# Altium project PowerUnit.PrjPCB
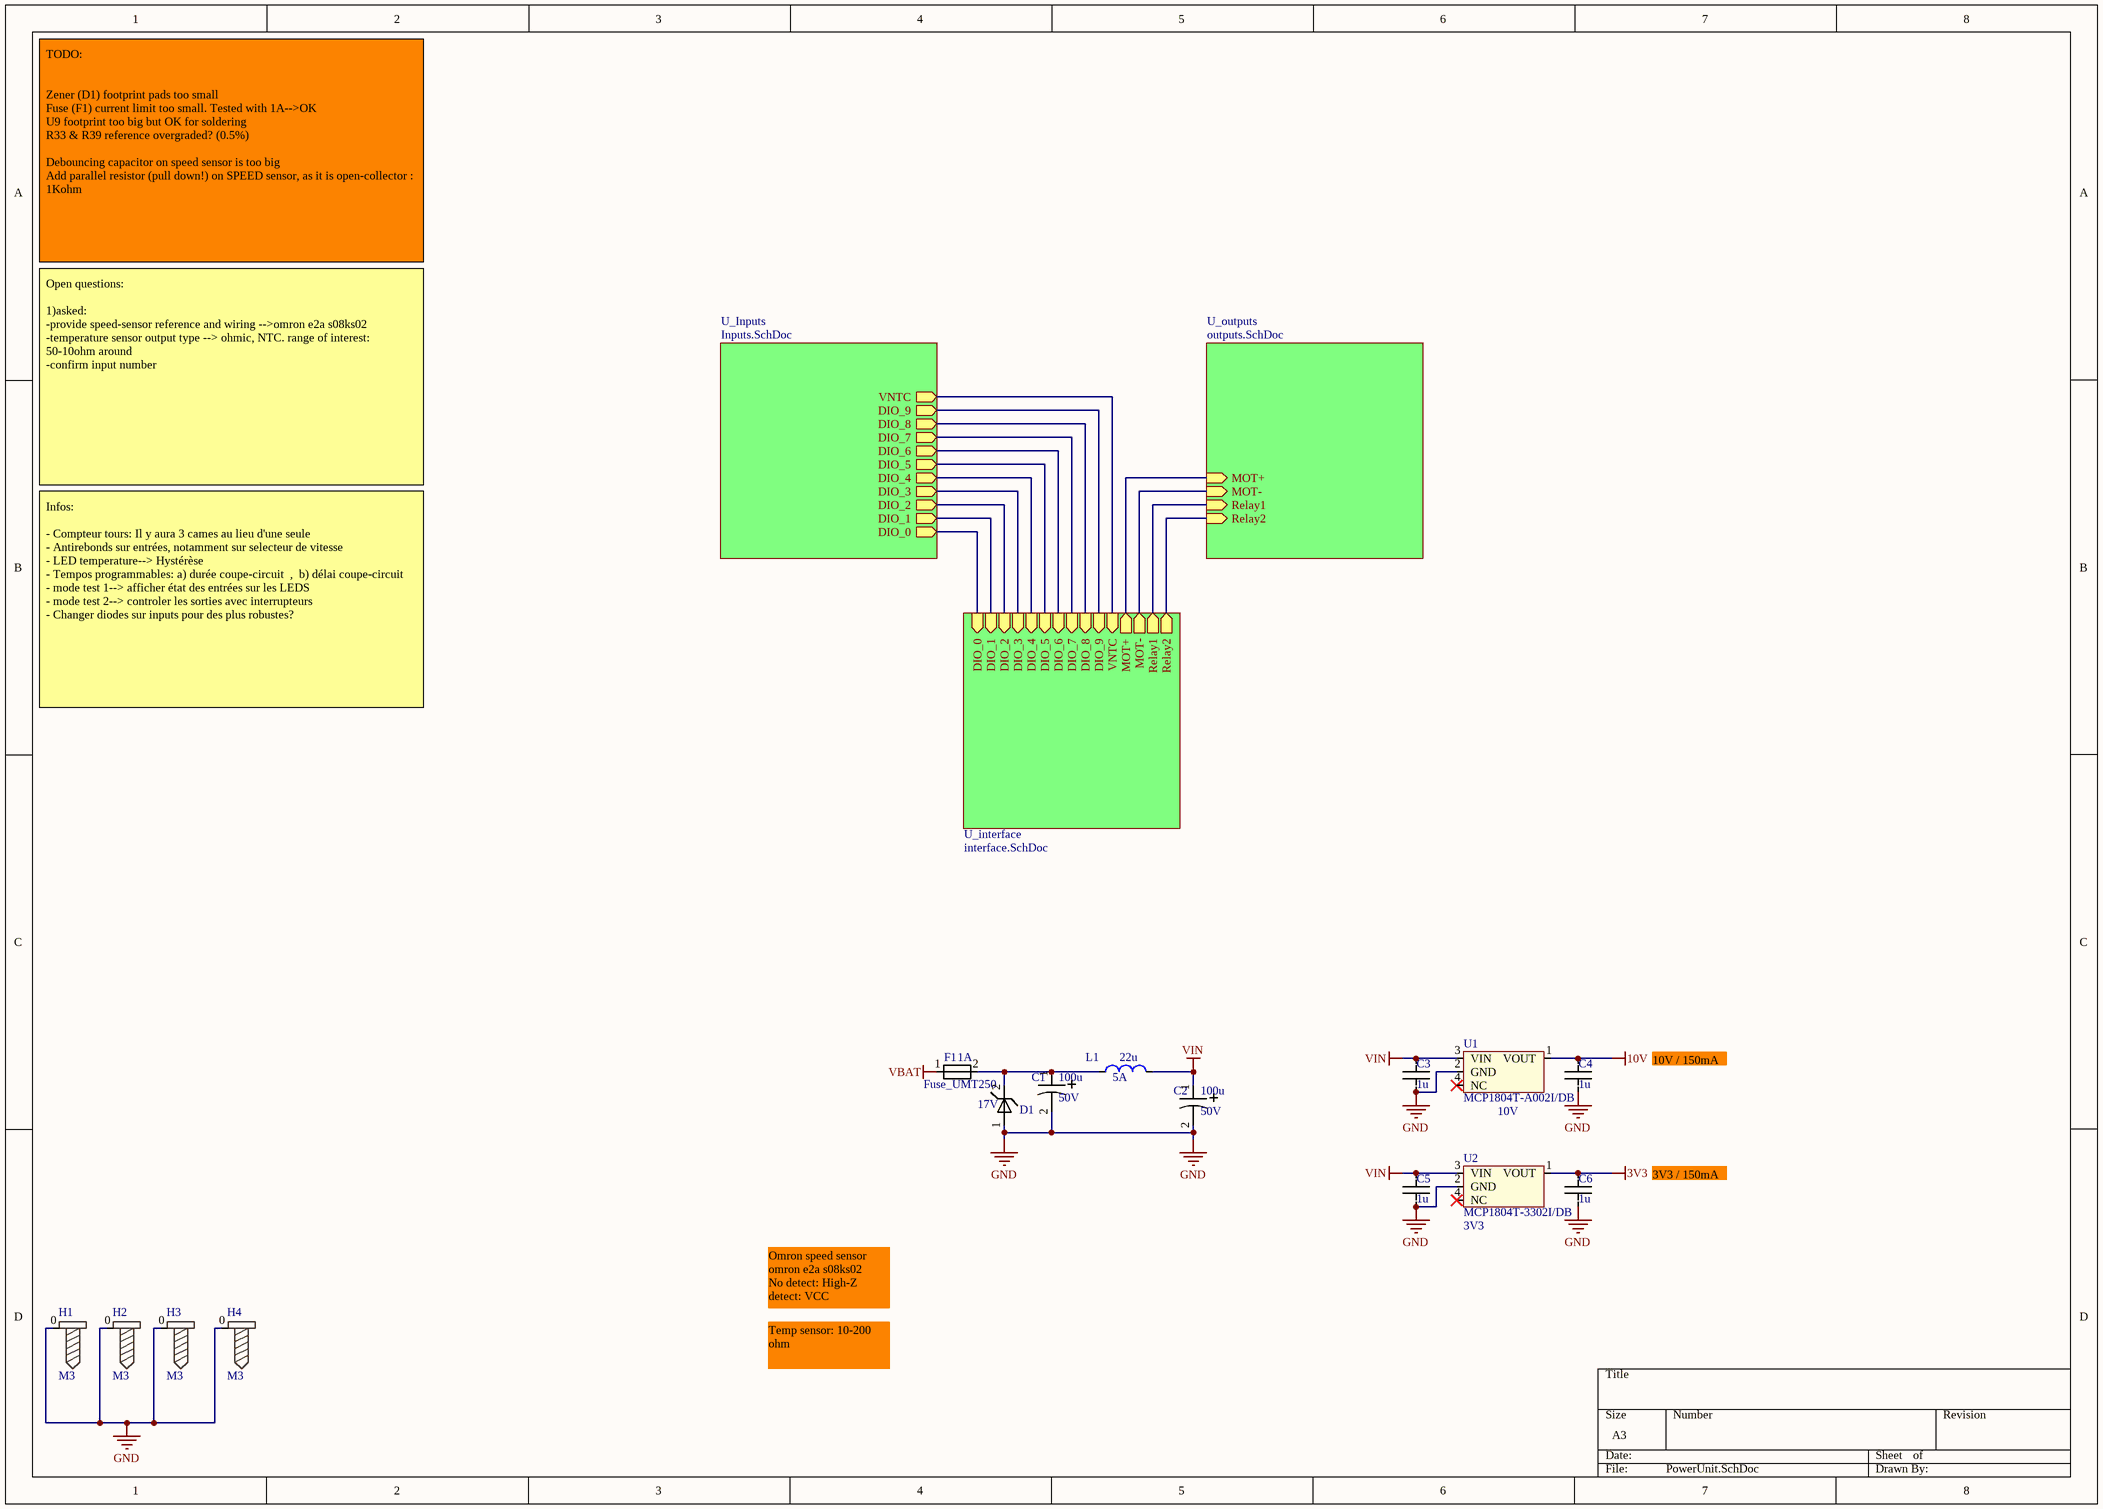
[diagram p0: PowerUnit.SchDoc]
4 sheets, 134 parts. Net scope: hierarchical (ports join the sheet entries above them; power ports are global).
Board file: PowerUnit.PcbDoc
Sheets:
  PowerUnit.SchDoc
    U_Inputs = Inputs.SchDoc
    U_outputs = outputs.SchDoc
    U_interface = interface.SchDoc

## Sheet PowerUnit.SchDoc
size A3

### Parts
C1  value 100u  Rated voltage: 50V  [C_pol8x12mm]  (hidden comment: C_pol)
C2  value 100u  Rated voltage: 50V  [C_pol8x12mm]  (hidden comment: C_pol)
C3  1u  [0402_]
C4  1u  [0402_]
C5  1u  [0402_]
C6  1u  [0402_]
D1  Vz: 17V  [R_DIL_vertical_holes1_2mm]  (hidden comment: Zener)
F1  Fuse_UMT250  Calibre: 1A  [FUSE_UMT250]
H1  M3  [Mechanical_hole]  (no BOM)
H2  M3  [Mechanical_hole]  (no BOM)
H3  M3  [Mechanical_hole]  (no BOM)
H4  M3  [Mechanical_hole]  (no BOM)
L1  value 22u  current: 5A  [WURTH_7447709220]  (hidden comment: Inductor)
U1  MCP1804T-A002I/DB  Output voltage: 10V  [SOT223-4M]
U2  MCP1804T-3302I/DB  Output voltage: 3V3  [SOT223-4M]

### Sub-sheets
U_Inputs = Inputs.SchDoc: DIO_0 (out), DIO_1 (out), DIO_2 (out), DIO_3 (out), DIO_4 (out), DIO_5 (out), DIO_6 (out), DIO_7 (out), VNTC (out), DIO_8 (out), DIO_9 (out)
U_interface = interface.SchDoc: DIO_0 (in), DIO_1 (in), DIO_2 (in), DIO_3 (in), DIO_4 (in), DIO_5 (in), DIO_6 (in), DIO_7 (in), VNTC (in), MOT+ (out), MOT- (out), DIO_8 (in), DIO_9 (in), Relay2 (out), Relay1 (out)
U_outputs = outputs.SchDoc: MOT+ (in), MOT- (in), Relay2 (in), Relay1 (in)

### Nets
3V3: C6.1 U2.1(VOUT)
10V: C4.1 U1.1(VOUT)
GND: C1.2 C2.2 C3.2 C4.2 C5.2 C6.2 D1.1 H1.0 H2.0 H3.0 H4.0 U1.2(GND) U2.2(GND)
VBAT: F1.1
VIN: C2.1 C3.1 C5.1 L1.2 U1.3(VIN) U2.3(VIN)
Embray_OUT: sheet U_Inputs/DIO_4, sheet U_interface/DIO_4
Gas_OUT: sheet U_Inputs/DIO_5, sheet U_interface/DIO_5
Huile_OUT: sheet U_Inputs/DIO_9, sheet U_interface/DIO_9
MOT+_IN: sheet U_outputs/MOT+, sheet U_interface/MOT+
MOT-_IN: sheet U_outputs/MOT-, sheet U_interface/MOT-
Neutre_OUT: sheet U_Inputs/DIO_6, sheet U_interface/DIO_6
P1_OUT: sheet U_Inputs/DIO_2, sheet U_interface/DIO_2
P2_OUT: sheet U_Inputs/DIO_1, sheet U_interface/DIO_1
Rapport+_OUT: sheet U_Inputs/DIO_0, sheet U_interface/DIO_0
Rapport-_OUT: sheet U_Inputs/DIO_3, sheet U_interface/DIO_3
Regime_OUT: sheet U_Inputs/DIO_8, sheet U_interface/DIO_8
RELAY1_IN: sheet U_outputs/Relay1, sheet U_interface/Relay1
RELAY2_IN: sheet U_outputs/Relay2, sheet U_interface/Relay2
Res_OUT: sheet U_Inputs/DIO_7, sheet U_interface/DIO_7
VNTC: sheet U_Inputs/VNTC, sheet U_interface/VNTC
NetC1_1: C1.1 D1.2 F1.2 L1.1

Not connected (* = marked no-connect by the designer): U1 4(NC)*; U2 4(NC)*

### Notes on the sheet
- TODO:
  Zener (D1) footprint pads too small
  Fuse (F1) current limit too small. Tested with 1A-->OK
  U9 footprint too big but OK for soldering
  R33 & R39 reference overgraded? (0.5%)
  Debouncing capacitor on speed sensor is too big
  Add parallel resistor (pull down!) on SPEED sensor, as it is open-collector : 1Kohm
- Open questions:
  1)asked:
  -provide speed-sensor reference and wiring -->omron e2a s08ks02
  -temperature sensor output type --> ohmic, NTC. range of interest: 50-10ohm around
  -confirm input number
- Infos:
  - Compteur tours: Il y aura 3 cames au lieu d'une seule
  - Antirebonds sur entrées, notamment sur selecteur de vitesse
  - LED temperature--> Hystérèse
  - Tempos programmables: a) durée coupe-circuit  ,  b) délai coupe-circuit
  - mode test 1--> afficher état des entrées sur les LEDS
  - mode test 2--> controler les sorties avec interrupteurs
  - Changer diodes sur inputs pour des plus robustes?
- 10V / 150mA
- 3V3 / 150mA
- Omron speed sensor
  omron e2a s08ks02
  No detect: High-Z
  detect: VCC
- Temp sensor: 10-200 ohm

### Library data of the parts
C1 C2 = C_pol: Manufacturer: Nichicon; Manufacturer PartNum: UVR1H101MPD1TD; Digikey ref: 493-5916-1-ND
C3-C6 = C: Manufacturer PartNum: GRM155R61E105MA12D; Manufacturer: Murata; Nominal voltage: 25V; value: 1u; Digikey ref: 490-10018-1-ND
D1 = Zener: Manufacturer: ON Semi; Manufacturer PartNum: 1N5354BG; Digikey ref: 1N5354BGOS-ND
F1 = Fuse_UMT250: Manufacturer PartNum: 3403.0166.11; Manufacturer: Schurter Inc; Unominal: 250V; Type: Temporisé; Digikey ref: 486-1247-ND; Farnell ref: 1221090; Mouser ref: 693-3403.0166.11
H1-H4 = trous_de_fixation: value: M3
L1 = Inductor: Manufacturer PartNum: 7447709220; Manufacturer: Wurth Electronics Inc; Digikey ref: 732-1243-1-ND; Digikey ref 2 (was unavailable): SRP1038A-220MCT-ND
U1 = MCP1804T-A002I/DB: IC REG LDO 10V 0.15A SOT223-3; Manufacturer: Microchip; Digikey ref: MCP1804T-A002I/DBCT-ND; Manufacturer PartNum: MCP1804T-A002I/DB
U2 = MCP1804T-3302I/DB: IC REG LDO 3.3V 0.15A SOT223-3; Manufacturer: Microchip; Digikey ref: MCP1804T-3302I/DBCT-ND; Manufacturer PartNum: MCP1804T-3302I/DB

## Sheet Inputs.SchDoc
size A3
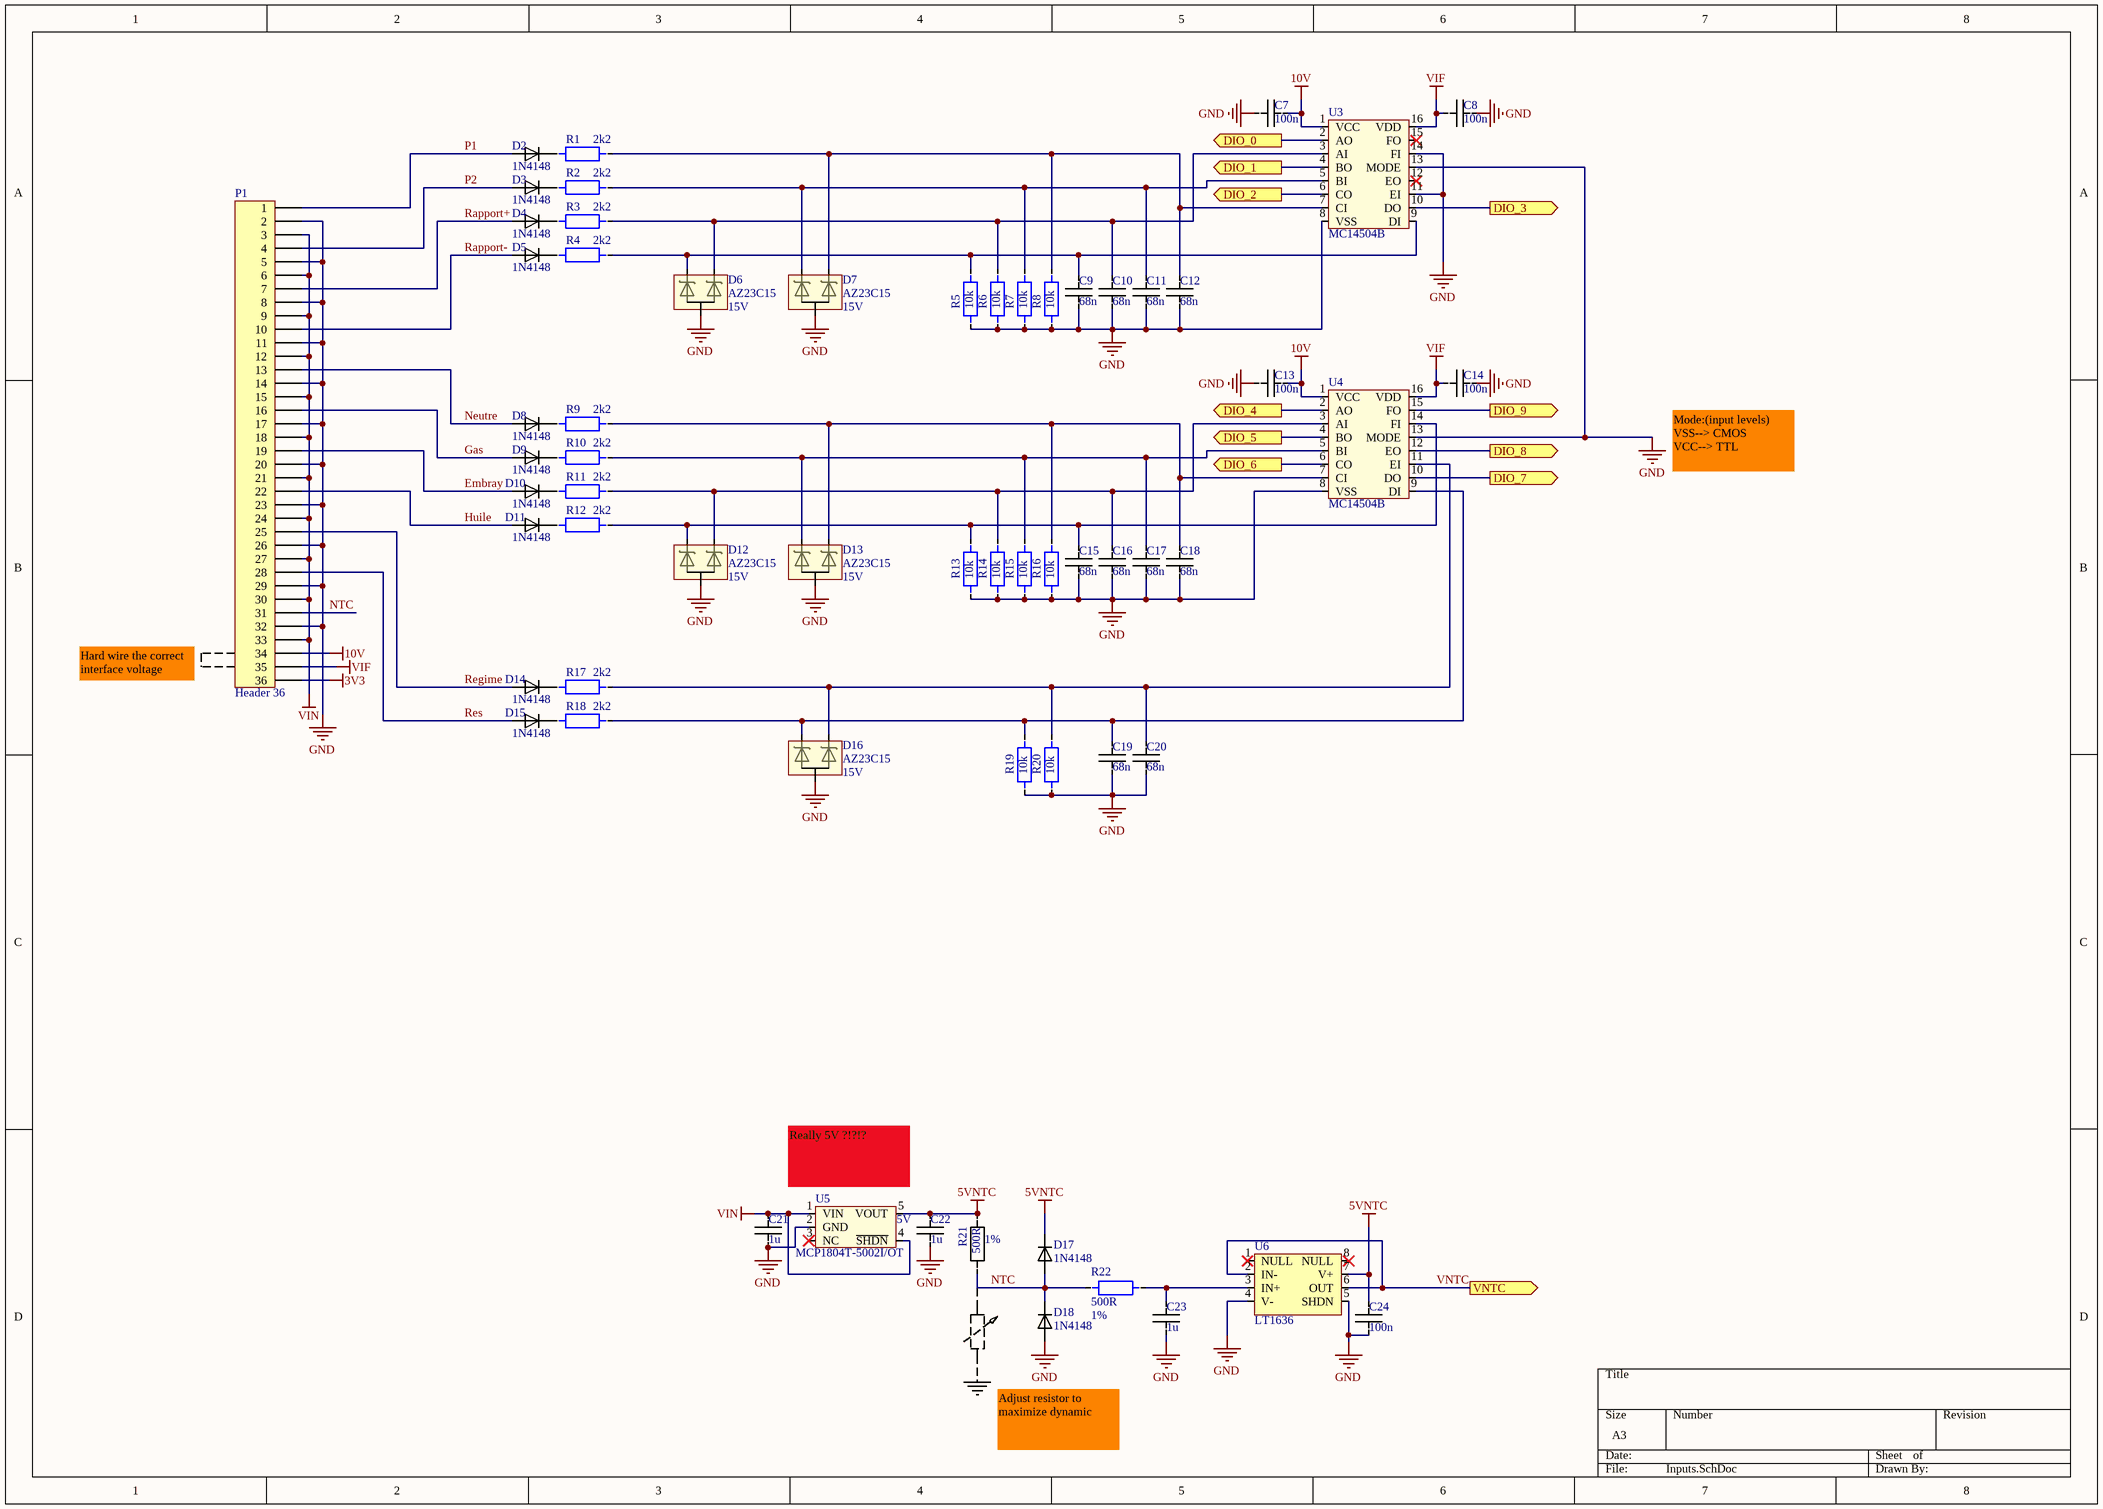
[diagram p1: Inputs.SchDoc]

### Parts
C7  100n  [0402_]
C8  100n  [0402_]
C9  68n  [0603_]
C10  68n  [0603_]
C11  68n  [0603_]
C12  68n  [0603_]
C13  100n  [0402_]
C14  100n  [0402_]
C15  68n  [0603_]
C16  68n  [0603_]
C17  68n  [0603_]
C18  68n  [0603_]
C19  68n  [0603_]
C20  68n  [0603_]
C21  1u  [0402_]
C22  1u  [0402_]
C23  1u  [0402_]
C24  100n  [0402_]
D2  1N4148  [SOD323]
D3  1N4148  [SOD323]
D4  1N4148  [SOD323]
D5  1N4148  [SOD323]
D6  AZ23C15  Vz: 15V  [SOT23]
D7  AZ23C15  Vz: 15V  [SOT23]
D8  1N4148  [SOD323]
D9  1N4148  [SOD323]
D10  1N4148  [SOD323]
D11  1N4148  [SOD323]
D12  AZ23C15  Vz: 15V  [SOT23]
D13  AZ23C15  Vz: 15V  [SOT23]
D14  1N4148  [SOD323]
D15  1N4148  [SOD323]
D16  AZ23C15  Vz: 15V  [SOT23]
D17  1N4148  [SOD323]
D18  1N4148  [SOD323]
P1  Header 36  [PHOENIX_PTSA05_36]
R1  2k2  [0805_]
R2  2k2  [0805_]
R3  2k2  [0805_]
R4  2k2  [0805_]
R5  10k  [0402_]
R6  10k  [0402_]
R7  10k  [0402_]
R8  10k  [0402_]
R9  2k2  [0805_]
R10  2k2  [0805_]
R11  2k2  [0805_]
R12  2k2  [0805_]
R13  10k  [0402_]
R14  10k  [0402_]
R15  10k  [0402_]
R16  10k  [0402_]
R17  2k2  [0805_]
R18  2k2  [0805_]
R19  10k  [0402_]
R20  10k  [0402_]
R21  precision: 1%  [0805_]  (hidden comment: 500R)
R22  precision: 1%  [0805_]  (hidden comment: 500R)
U3  MC14504B  [SOIC16]
U4  MC14504B  [SOIC16]
U5  MCP1804T-5002I/OT  Rated volatage: 5V  [sot23-5]
U6  LT1636  [soic8]

### Ports
DIO_0 (out), DIO_1 (out), DIO_2 (out), DIO_3 (out), DIO_4 (out), DIO_5 (out), DIO_6 (out), DIO_7 (out), DIO_8 (out), DIO_9 (out), VNTC (out)

### Nets
3V3: P1.36
5VNTC: C22.1 C24.1 D17.2 R21.2 U5.5(VOUT) U6.7(V+)
10V: C7.1 C13.1 P1.34 U3.1(VCC) U4.1(VCC)
GND: C7.2 C8.1 C9.1 C10.1 C11.1 C12.1 C13.2 C14.1 C15.1 C16.1 C17.1 C18.1 C19.1 C20.1 C21.2 C22.2 C23.2 C24.2 D6.3 D7.3 D12.3 D13.3 D16.3 D18.1 P1.2 P1.5 P1.8 P1.11 P1.14 P1.17 P1.20 P1.23 P1.26 P1.29 P1.32 R5.1 R6.1 R7.1 R8.1 R13.1 R14.1 R15.1 R16.1 R19.1 R20.1 U3.8(VSS) U3.11(EI) U3.13(MODE) U3.14(FI) U4.8(VSS) U4.13(MODE) U5.2(GND) U6.4(V-) U6.5(SHDN)
VIF: C8.2 C14.2 P1.35 U3.16(VDD) U4.16(VDD)
VIN: C21.1 P1.3 P1.6 P1.9 P1.12 P1.15 P1.18 P1.21 P1.24 P1.27 P1.30 P1.33 U5.1(VIN) U5.4(~{SHDN})
Embray: D10.1 P1.19
Embray_OUT: U4.2(AO) ; port DIO_4
Gas: D9.1 P1.16
Gas_OUT: U4.4(BO) ; port DIO_5
Huile: D11.1 P1.22
Huile_OUT: U4.15(FO) ; port DIO_9
Neutre: D8.1 P1.13
Neutre_OUT: U4.6(CO) ; port DIO_6
NTC: D17.1 D18.2 P1.31 R21.1 R22.2
P1: D2.1 P1.1
P1_OUT: U3.6(CO) ; port DIO_2
P2: D3.1 P1.4
P2_OUT: U3.4(BO) ; port DIO_1
Rapport+: D4.1 P1.7
Rapport+_OUT: U3.2(AO) ; port DIO_0
Rapport-: D5.1 P1.10
Rapport-_OUT: U3.10(DO) ; port DIO_3
Regime: D14.1 P1.25
Regime_OUT: U4.12(EO) ; port DIO_8
Res: D15.1 P1.28
Res_OUT: U4.10(DO) ; port DIO_7
VNTC: U6.2(IN-) U6.6(OUT) ; port VNTC
NetC9_2: C9.2 D6.2 R4.1 R5.2 U3.9(DI)
NetC10_2: C10.2 D6.1 R3.1 R6.2 U3.3(AI)
NetC11_2: C11.2 D7.2 R2.1 R7.2 U3.5(BI)
NetC12_2: C12.2 D7.1 R1.1 R8.2 U3.7(CI)
NetC15_2: C15.2 D12.2 R12.1 R13.2 U4.14(FI)
NetC16_2: C16.2 D12.1 R11.1 R14.2 U4.3(AI)
NetC17_2: C17.2 D13.2 R10.1 R15.2 U4.5(BI)
NetC18_2: C18.2 D13.1 R9.1 R16.2 U4.7(CI)
NetC19_2: C19.2 D16.2 R18.1 R19.2 U4.9(DI)
NetC20_2: C20.2 D16.1 R17.1 R20.2 U4.11(EI)
NetC23_1: C23.1 R22.1 U6.3(IN+)
NetD2_2: D2.2 R1.2
NetD3_2: D3.2 R2.2
NetD4_2: D4.2 R3.2
NetD5_2: D5.2 R4.2
NetD8_2: D8.2 R9.2
NetD9_2: D9.2 R10.2
NetD10_2: D10.2 R11.2
NetD11_2: D11.2 R12.2
NetD14_2: D14.2 R17.2
NetD15_2: D15.2 R18.2

Not connected (* = marked no-connect by the designer): U3 12(EO)* 15(FO)*; U5 3(NC)*; U6 1(NULL)* 8(NULL)*

### Notes on the sheet
- Mode:(input levels)
  VSS--> CMOS
  VCC--> TTL
- Hard wire the correct interface voltage
- Really 5V ?!?!?
- Adjust resistor to maximize dynamic

### Library data of the parts
C7 C8 C13 C14 = C: Manufacturer: TDK Corp.; Manufacturer PartNum: C1005X5R1E104K050BC; value: 100n; Digikey ref: 445-4964-1-ND
C9-C12 C15-C20 = C: Manufacturer: Samsung; Manufacturer PartNum: CL10B683KB8NNNC; Nominal voltage: 50V; Digikey ref: 1276-1814-1-ND; Value: 68n
C21-C23 = C: as C3 on sheet PowerUnit; value: 1u; Digikey ref: 490-10018-1-ND
C24 = C: Manufacturer: TDK Corp.; Manufacturer PartNum: C1005X5R1E104K050BC; Voltage: 25V; value: 100n; Digikey ref: 445-4964-1-ND
D2-D5 D8-D11 D14 D15 D17 D18 = 1N4148: Manufacturer: Micro Commercial Co; Manufacturer PartNum: 1N4148WX-TP; Digikey ref: 1N4148WXTPMSCT-ND
D6 D7 D12 D13 D16 = AZ23C15: DIODE ZENER ARRAY 15V SOT23-3; Manufacturer PartNum: AZ23C15-7-F; Manufacturer: Diodes Inc.; Digikey ref: AZ23C15-FDICT-ND
P1 = Header 36: Header, 36-Pin; Manufacturer PartNum: 1990164; Manufacturer: Phoenix Contact; LatestRevisionDate: 17-Jul-2002; LatestRevisionNote: Re-released for DXP Platform.; Publisher: Altium Limited; Digikey ref: 277-1810-ND
R1-R4 R9-R12 R17 R18 = R: Manufacturer: Yageo; Manufacturer PartNum: RC0805JR-072K2L; value: 2k2; Digikey ref: 311-2.2KARCT-ND
R5-R8 R13-R16 R19 R20 = R: Manufacturer PartNum: ERJ-2RKF1002X; Manufacturer: Panasonic; value: 10k; Digikey ref: P10.0KLCT-ND
R21 R22 = R: Manufacturer PartNum: RC0805FR-07510RL; Manufacturer: Yageo; value: 500R; Digikey ref: 311-510CRCT-ND
U3 U4 = MC14504B: IC LEVEL SHIFTER HEX 16-SOIC; Manufacturer: On Semi; Manufacturer PartNum: MC14504BDG; Digikey ref: MC14504BDGOS-ND
U5 = MCP1804T-5002I/OT: IC REG LDO 5V 0.15A SOT23-5; Manufacturer: Microchip; Digikey ref: MCP1804T-5002I/OTCT-ND; Manufacturer PartNum: MCP1804T-5002I/OT
U6 = LT1636: IC OPAMP GP 220KHZ RRO 8SO SHTDN; Manufacturer PartNum: LT1636CS8#PBF; Manufacturer: Linear Technology; Digikey ref: LT1636CS8#PBF-ND

## Sheet outputs.SchDoc
size A3
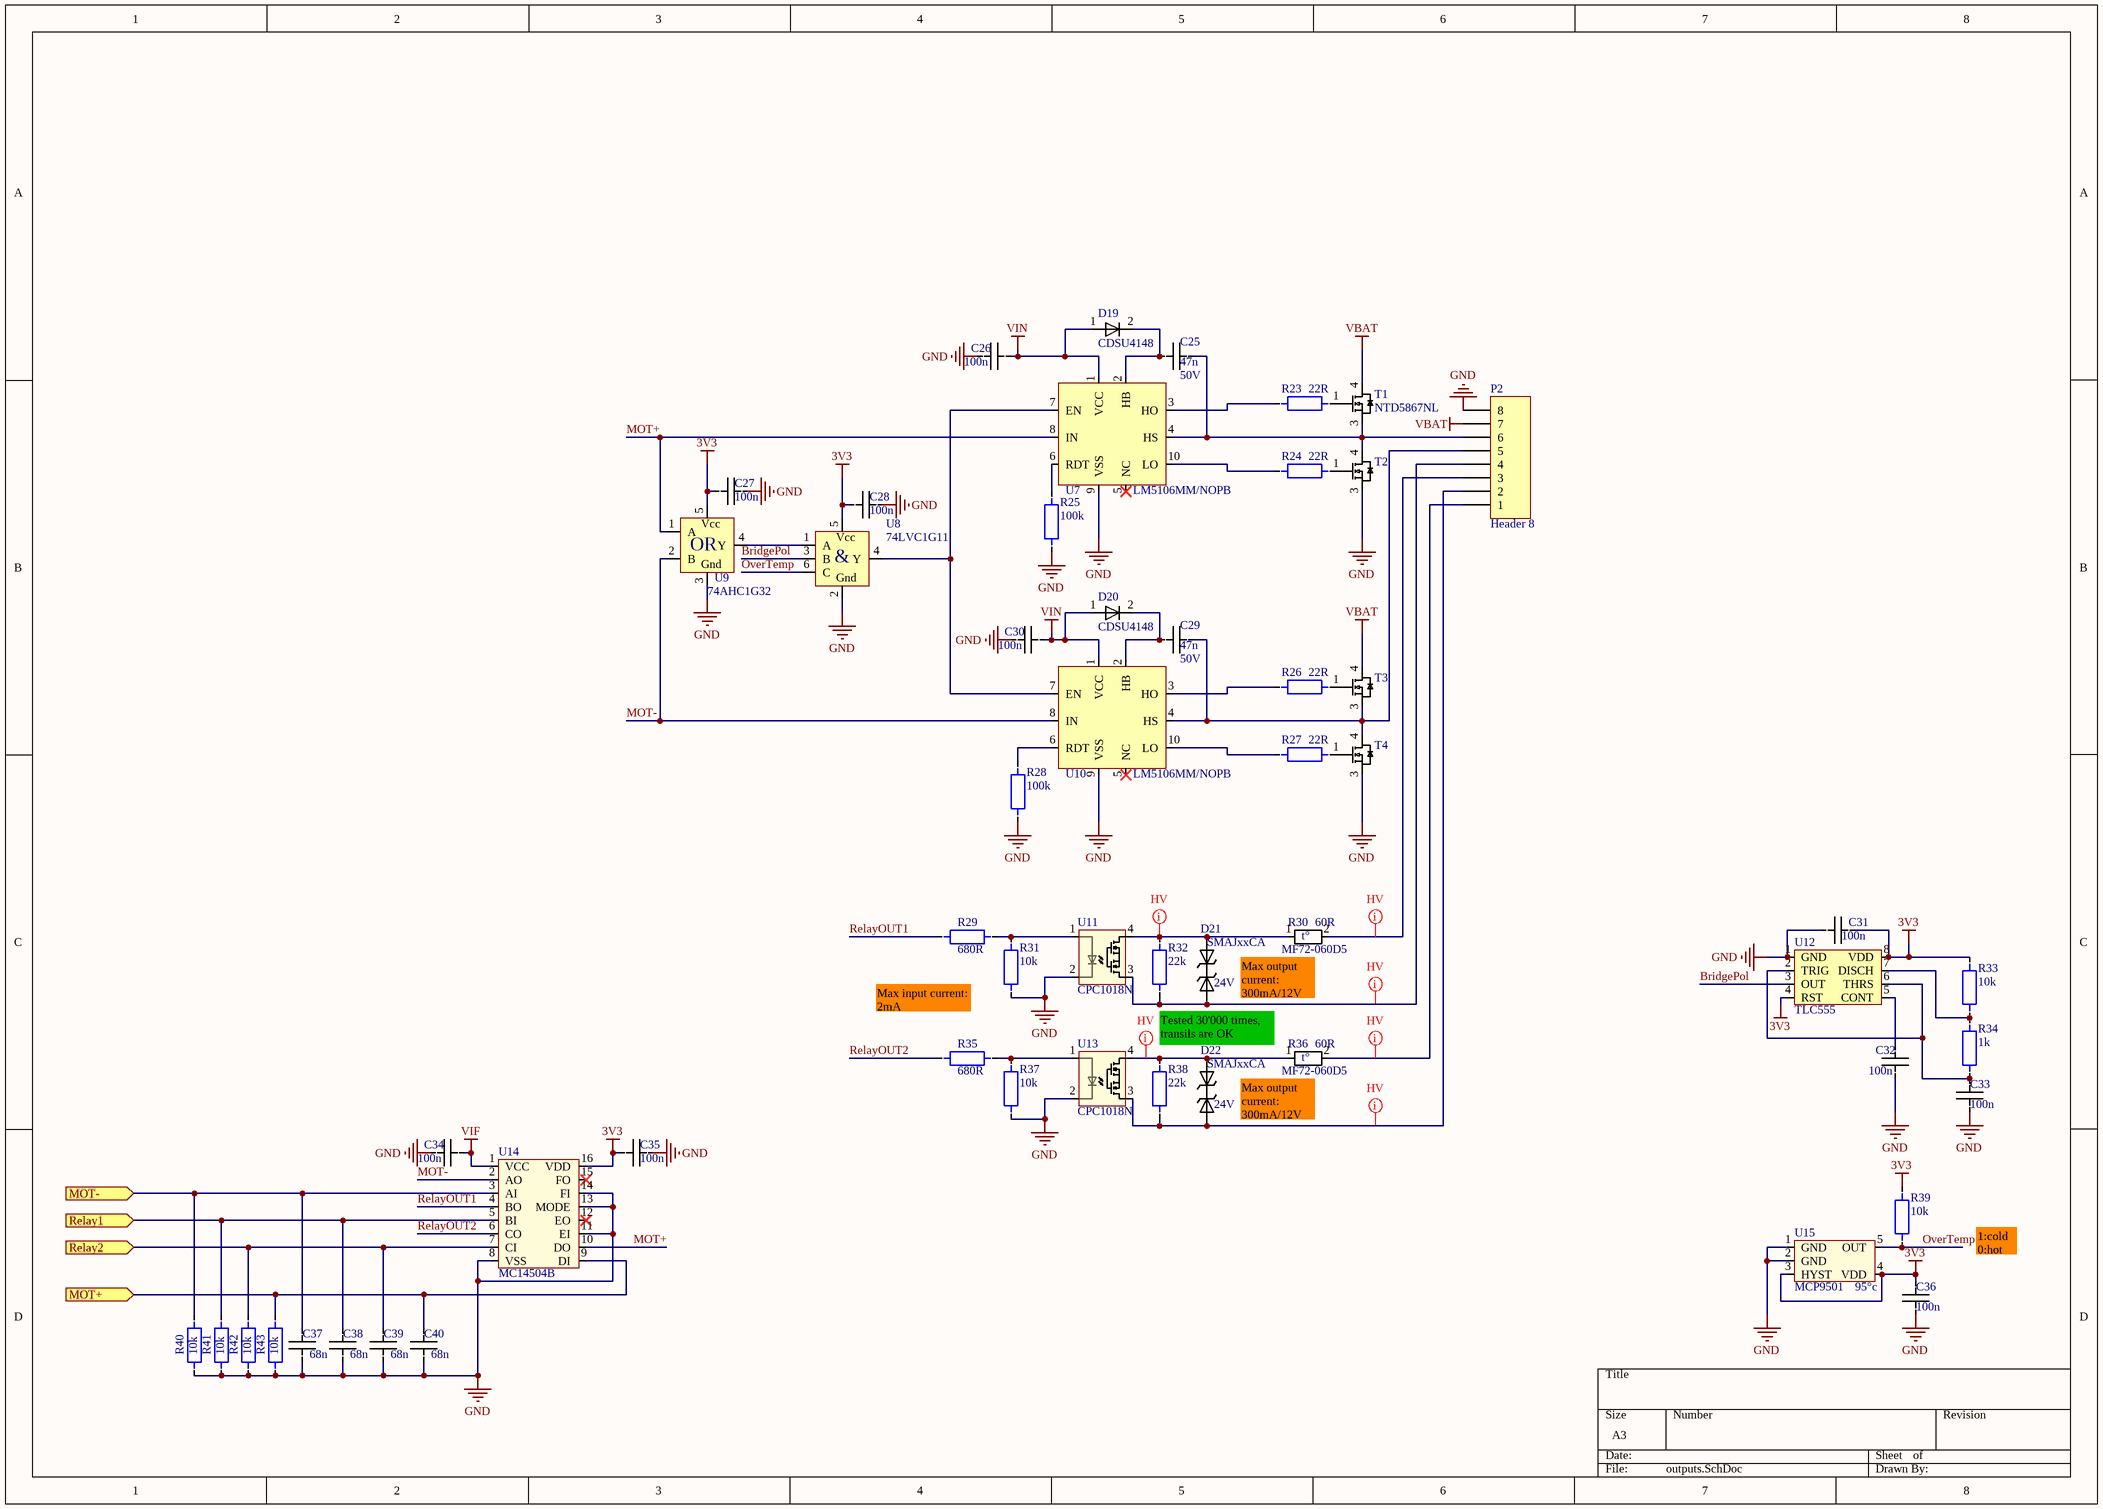
[diagram p2: outputs.SchDoc]

### Parts
C25  Voltage: 50V  [0402_]  (hidden comment: 47n)
C26  100n  [0402_]
C27  100n  [0402_]
C28  100n  [0402_]
C29  Voltage: 50V  [0402_]  (hidden comment: 47n)
C30  100n  [0402_]
C31  100n  [0402_]
C32  100n  [0402_]
C33  100n  [0402_]
C34  100n  [0402_]
C35  100n  [0402_]
C36  100n  [0402_]
C37  68n  [0603_]
C38  68n  [0603_]
C39  68n  [0603_]
C40  68n  [0603_]
D19  CDSU4148  [0603_Pol]
D20  CDSU4148  [0603_Pol]
D21  SMAJxxCA  Vbreakdown: 24V  [DO-214AC]
D22  SMAJxxCA  Vbreakdown: 24V  [DO-214AC]
P2  Header 8  [PHOENIX_SMKDSN8]
R23  22R  [0805_]
R24  22R  [0805_]
R25  100k  [0402_]
R26  22R  [0805_]
R27  22R  [0805_]
R28  100k  [0402_]
R29  680R  [0402_]
R30  MF72-060D5  Value@25°c: 60R  [MF72-010D5]
R31  10k  [0402_]
R32  22k  [0805_]
R33  10k  [0402_]
R34  1k  [0402_]
R35  680R  [0402_]
R36  MF72-060D5  Value@25°c: 60R  [MF72-010D5]
R37  10k  [0402_]
R38  22k  [0805_]
R39  10k  [0402_]
R40  10k  [0402_]
R41  10k  [0402_]
R42  10k  [0402_]
R43  10k  [0402_]
T1  NTD5867NL  [DPAK]
T2  NTD5867NL  [DPAK]  (value not drawn)
T3  NTD5867NL  [DPAK]  (value not drawn)
T4  NTD5867NL  [DPAK]  (value not drawn)
U7  LM5106MM/NOPB  [VSSOP10]
U8  74LVC1G11  [SOT363]
U9  74AHC1G32  [SOT353]
U10  LM5106MM/NOPB  [VSSOP10]
U11  CPC1018N  [CPC10xxN]
U12  TLC555  [soic8]
U13  CPC1018N  [CPC10xxN]
U14  MC14504B  [SOIC16]
U15  MCP9501  TSET: 95°c  [SOT23-5]

### Ports
MOT+ (in), MOT- (in), Relay1 (in), Relay2 (in)

### Nets
3V3: C27.1 C28.1 C31.2 C35.2 C36.1 R33.2 R39.2 U8.5(Vcc) U9.5(VCC) U12.4(RST) U12.8(VDD) U14.16(VDD) U15.3(HYST) U15.4(VDD)
GND: C26.1 C27.2 C28.2 C30.1 C31.1 C32.1 C33.1 C34.1 C35.1 C36.2 C37.1 C38.1 C39.1 C40.1 P2.8 R25.1 R28.1 R31.1 R37.1 R40.1 R41.1 R42.1 R43.1 T2.3(S) T4.3(S) U7.9(VSS) U8.2(GND) U9.3(GND) U10.9(VSS) U11.2(Ca) U12.1(GND) U13.2(Ca) U14.8(VSS) U14.11(EI) U14.13(MODE) U14.14(FI) U15.1(GND) U15.2(GND)
VBAT: P2.7 T1.4(D) T3.4(D)
VIF: C34.2 U14.1(VCC)
VIN: C26.2 C30.2 D19.1 D20.1 U7.1(VCC) U10.1(VCC)
BridgePol: U8.3(B) U12.3(OUT)
MOT+: U7.8(IN) U9.1(A) U14.10(DO)
MOT+_IN: C40.2 R43.2 U14.9(DI) ; port MOT+
MOT-: U9.2(B) U10.8(IN) U14.2(AO)
MOT-_IN: C37.2 R40.2 U14.3(AI) ; port MOT-
OverTemp: R39.1 U8.6(C) U15.5(OUT)
RELAY1_IN: C38.2 R41.2 U14.5(BI) ; port Relay1
RELAY2_IN: C39.2 R42.2 U14.7(CI) ; port Relay2
RelayOUT1: R29.2 U14.4(BO)
RelayOUT2: R35.2 U14.6(CO)
NetC25_1: C25.1 D19.2 U7.2(HB)
NetC25_2: C25.2 P2.6 T1.3(S) T2.4(D) U7.4(HS)
NetC29_1: C29.1 D20.2 U10.2(HB)
NetC29_2: C29.2 P2.5 T3.3(S) T4.4(D) U10.4(HS)
NetC32_2: C32.2 U12.5(CONT)
NetC33_2: C33.2 R34.2 U12.2(TRIG) U12.6(THRS)
NetD21_1: D21.1 P2.4 R32.1 U11.3(DC-)
NetD21_2: D21.2 R30.1 R32.2 U11.4(DC+)
NetD22_1: D22.1 P2.2 R38.1 U13.3(DC-)
NetD22_2: D22.2 R36.1 R38.2 U13.4(DC+)
NetP2_1: P2.1 R36.2
NetP2_3: P2.3 R30.2
NetR23_1: R23.1 T1.1(G)
NetR23_2: R23.2 U7.3(HO)
NetR24_1: R24.1 T2.1(G)
NetR24_2: R24.2 U7.10(LO)
NetR25_2: R25.2 U7.6(RDT)
NetR26_1: R26.1 T3.1(G)
NetR26_2: R26.2 U10.3(HO)
NetR27_1: R27.1 T4.1(G)
NetR27_2: R27.2 U10.10(LO)
NetR28_2: R28.2 U10.6(RDT)
NetR29_1: R29.1 R31.2 U11.1(A)
NetR33_1: R33.1 R34.1 U12.7(DISCH)
NetR35_1: R35.1 R37.2 U13.1(A)
NetU7_7: U7.7(EN) U8.4(Y) U10.7(EN)
NetU8_1: U8.1(A) U9.4(Y)

Not connected (* = marked no-connect by the designer): U7 5(NC)*; U10 5(NC)*; U14 12(EO)* 15(FO)*

### Layout directives
net class HV_NET: NetD21_1, NetD21_2, NetD22_1, NetD22_2, NetP2_1, NetP2_3

### Notes on the sheet
- Max output current: 300mA/12V
- Max input current: 2mA
- Tested 30'000 times, transils are OK
- 1:cold
  0:hot
- (in symbol 74AHC1G32) Vcc; OR; Gnd
- (in symbol 74LVC1G11) &; Gnd
- (in symbol MF72-060D5) t°

### Library data of the parts
C25 C29 = C: Manufacturer: Murata; Manufacturer PartNum: GRM155R71H473KE14D; value: 47n; Digikey ref: 490-10702-1-ND
C26 C30 C34 C35 = C: as C7 on sheet Inputs; value: 100n; Digikey ref: 445-4964-1-ND
C27 C28 C31-C33 C36 = C: as C24 on sheet Inputs; value: 100n; Digikey ref: 445-4964-1-ND
C37-C40 = C: as C9 on sheet Inputs; Digikey ref: 1276-1814-1-ND; Value: 68n
D19 D20 = CDSU4148: Manufacturer: Comchip Tech.; Imax: 150mA; VF@Imax: 1; Farnell ref: *; Digikey ref: 641-1001-1-ND; Manufacturer PartNum: CDSU4148
D21 D22 = SMAJxxCA: SMAJ Transient Voltage Suppressor Diode Series; Manufacturer PartNum: SMAJ24CA; Manufacturer: Littelfuse Inc; Digikey ref: SMAJ24CALFCT-ND
P2 = Header 8: Header, 8-Pin; Manufacturer PartNum: 1869279; Manufacturer: Phoenix; LatestRevisionDate: 17-Jul-2002; LatestRevisionNote: Re-released for DXP Platform.; Publisher: Altium Limited; Digikey ref: 277-5855-ND
R23 R24 R26 R27 = R: Manufacturer PartNum: ERJ-6ENF22R0V; Manufacturer: Panasonic; value: 22R; Digikey ref: P22.0CCT-ND
R25 R28 = R: Manufacturer: Susumu; Manufacturer PartNum: RR0510P-104-D; value: 100k; Digikey ref: RR05P100KDCT-ND
R29 R35 = R: Manufacturer PartNum: ERJ-2RKF6800X; Manufacturer: Panasonic; value: 680R; Digikey ref: P680LCT-ND
R30 R36 = MF72-060D5: Manufacturer: Cantherm; Digikey ref: 317-1146-ND; Manufacturer PartNum: MF72-060D5
R31 R33 R37 R39-R43 = R: as R5 on sheet Inputs; value: 10k; Digikey ref: P10.0KLCT-ND
R32 R38 = R: Manufacturer: Rohm Semi; Manufacturer PartNum: ESR10EZPJ223; value: 22k; Digikey ref: RHM22KKCT-ND
R34 = R: Manufacturer PartNum: MCR01MRTF1001; Manufacturer: Rohm Semi; value: 1k; Digikey ref: RHM1.00KCDCT-ND
T1-T4 = NTD5867NL: Manufacturer: On Semi; Manufacturer PartNum: NTD5867NLT4G; Digikey ref: NTD5867NLT4GOSCT-ND
U7 U10 = LM5106MM/NOPB: Manufacturer: Texas Intruments; Digikey ref: LM5106MM/NOPBCT-ND; Manufacturer PartNum: LM5106MM/NOPB
U8 = 74LVC1G11: IC GATE AND 1CH 3-INP SOT-363; Manufacturer: Diodes Inc.; Manufacturer PartNum: 74LVC1G11DW-7; Digikey ref: 74LVC1G11DW-7CT-ND
U9 = 74AHC1G32: Manufacturer: Diodes Inc.; Manufacturer PartNum: 74AHC1G32SE-7; Digikey ref: 74AHC1G32SE-7DICT-ND
U11 U13 = CPC1018N: Manufacturer PartNum: CPC1018NTR; Manufacturer: IXYS Integrated; Digikey ref: CLA225CT-ND; Farnell ref: *
U12 = TLC555: IC OSC SGL TIMER 2.1MHZ 8-SOIC; Manufacturer: Texas Intruments; Manufacturer PartNum: TLC555CDR; Digikey ref: 296-1336-1-ND
U14 = MC14504B: as U3 on sheet Inputs; Digikey ref: MC14504BDGOS-ND
U15 = MCP9501: Manufacturer: Microchip; Manufacturer PartNum: MCP9501PT-095E/OT; Digikey ref: MCP9501PT-095E/OTCT-ND

## Sheet interface.SchDoc
size A4
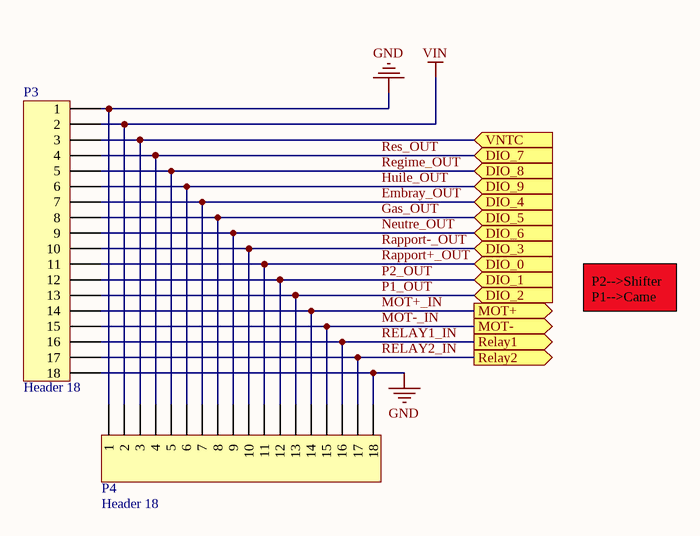
[diagram p3: interface.SchDoc]

### Parts
P3  Header 18  [PHOENIX_PTSA05_18]
P4  Header 18  [HDR1X18]

### Ports
DIO_0 (in), DIO_1 (in), DIO_2 (in), DIO_3 (in), DIO_4 (in), DIO_5 (in), DIO_6 (in), DIO_7 (in), DIO_8 (in), DIO_9 (in), MOT+ (out), MOT- (out), Relay1 (out), Relay2 (out), VNTC (in)

### Nets
GND: P3.1 P3.18 P4.1 P4.18
VIN: P3.2 P4.2
Embray_OUT: P3.7 P4.7 ; port DIO_4
Gas_OUT: P3.8 P4.8 ; port DIO_5
Huile_OUT: P3.6 P4.6 ; port DIO_9
MOT+_IN: P3.14 P4.14 ; port MOT+
MOT-_IN: P3.15 P4.15 ; port MOT-
Neutre_OUT: P3.9 P4.9 ; port DIO_6
P1_OUT: P3.13 P4.13 ; port DIO_2
P2_OUT: P3.12 P4.12 ; port DIO_1
Rapport+_OUT: P3.11 P4.11 ; port DIO_0
Rapport-_OUT: P3.10 P4.10 ; port DIO_3
Regime_OUT: P3.5 P4.5 ; port DIO_8
RELAY1_IN: P3.16 P4.16 ; port Relay1
RELAY2_IN: P3.17 P4.17 ; port Relay2
Res_OUT: P3.4 P4.4 ; port DIO_7
VNTC: P3.3 P4.3 ; port VNTC

### Notes on the sheet
- P2-->Shifter
  P1-->Came

### Library data of the parts
P3 = Header 18: Header, 10-Pin; manufacturer PartNum: 1990164; Manufacturer: Phoenix; LatestRevisionDate: 17-Jul-2002; LatestRevisionNote: Re-released for DXP Platform.; Publisher: Altium Limited; Digikey ref: 277-1810-ND
P4 = Header 18: Header, 10-Pin; LatestRevisionDate: 17-Jul-2002; LatestRevisionNote: Re-released for DXP Platform.; Publisher: Altium Limited

## Nets that join several sheets
3V3: PowerUnit (C6.1 U2.1), Inputs (P1.36), outputs (14 pins)
10V: PowerUnit (C4.1 U1.1), Inputs (5 pins)
GND: PowerUnit (13 pins), Inputs (54 pins), outputs (38 pins), interface (P3.1 P3.18 P4.1 P4.18)
VBAT: PowerUnit (F1.1), outputs (P2.7 T1.4 T3.4)
VIF: Inputs (5 pins), outputs (C34.2 U14.1)
VIN: PowerUnit (6 pins), Inputs (14 pins), outputs (6 pins), interface (P3.2 P4.2)
Embray_OUT: Inputs (U4.2), interface (P3.7 P4.7)
Gas_OUT: Inputs (U4.4), interface (P3.8 P4.8)
Huile_OUT: Inputs (U4.15), interface (P3.6 P4.6)
MOT+_IN: outputs (C40.2 R43.2 U14.9), interface (P3.14 P4.14)
MOT-_IN: outputs (C37.2 R40.2 U14.3), interface (P3.15 P4.15)
Neutre_OUT: Inputs (U4.6), interface (P3.9 P4.9)
P1_OUT: Inputs (U3.6), interface (P3.13 P4.13)
P2_OUT: Inputs (U3.4), interface (P3.12 P4.12)
Rapport+_OUT: Inputs (U3.2), interface (P3.11 P4.11)
Rapport-_OUT: Inputs (U3.10), interface (P3.10 P4.10)
Regime_OUT: Inputs (U4.12), interface (P3.5 P4.5)
RELAY1_IN: outputs (C38.2 R41.2 U14.5), interface (P3.16 P4.16)
RELAY2_IN: outputs (C39.2 R42.2 U14.7), interface (P3.17 P4.17)
Res_OUT: Inputs (U4.10), interface (P3.4 P4.4)
VNTC: Inputs (U6.2 U6.6), interface (P3.3 P4.3)

## Assembly variants
Prod: not fitted P4